# Altium project Soldeerbout_12002498.PrjPcb
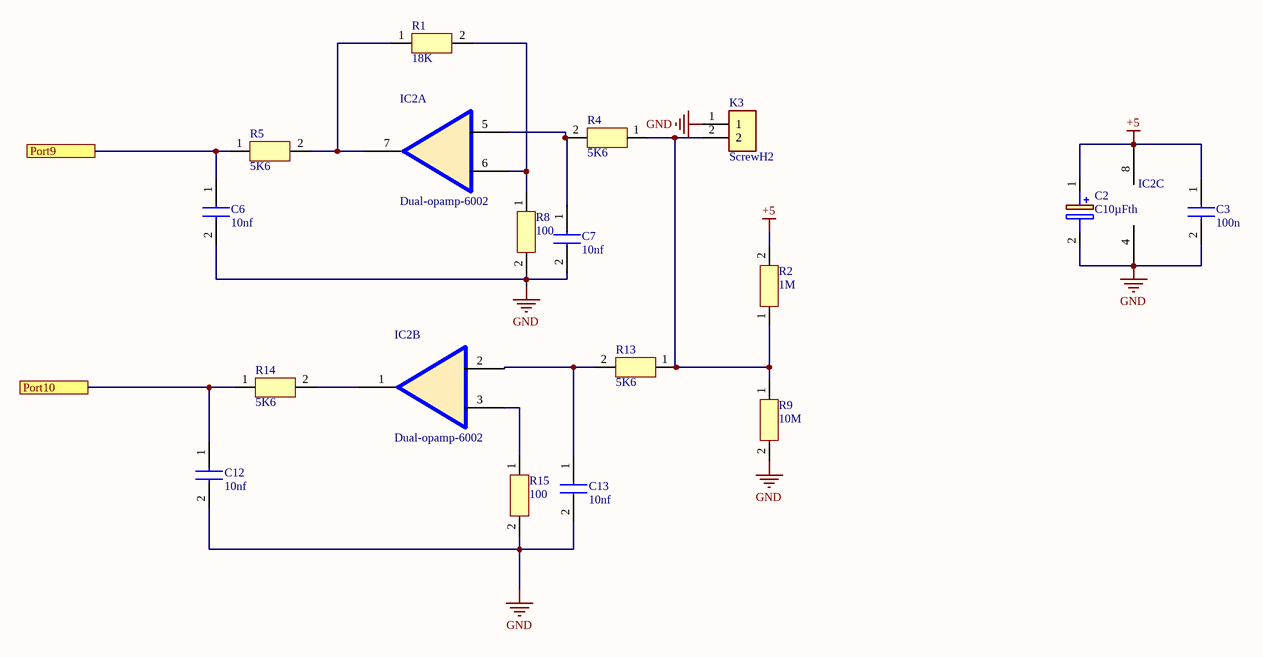
[diagram p0: Versterkers.SchDoc]
4 sheets, 53 parts. Net scope: flat (ports and power ports of the same name join across sheets).
Board file: Soldeerbout12002498.PcbDoc
Sheets:
  Versterkers.SchDoc
  Voeding.SchDoc
  Microchip.SchDoc
  TM16+LED.SchDoc

## Sheet Versterkers.SchDoc
size A4; SheetNumber: 2; SheetTotal: 5

### Parts
C2  C10µFth  [C10µFth]
C3  100n  [0805]
C6  10nf  [0805]
C7  10nf  [0805]
C12  10nf  [0805]
C13  10nf  [0805]
IC2  Dual-opamp-6002  [Dual-opamp-6002]  (parts A,B,C of 3)
K3  ScrewH2  [ScewH2]
R1  18K  [0805]
R2  1M  [0805]
R4  5K6  [0805]
R5  5K6  [0805]
R8  100  [0805]
R9  10M  [0805]
R13  5K6  [0805]
R14  5K6  [0805]
R15  100  [0805]

### Ports
Port9, Port10

### Nets
+5: C2.1(+) C3.1 IC2.8 R2.2
GND: C2.2(-) C3.2 C6.2 C7.2 C12.2 C13.2 IC2.4 K3.1 R8.2 R9.2 R15.2
NetC6_1: C6.1 R5.1 ; port Port9
NetC7_1: C7.1 IC2.5(Vin) R4.2
NetC12_1: C12.1 R14.1 ; port Port10
NetC13_1: C13.1 IC2.2(Vin) R13.2
NetIC2_1: IC2.1(Vout) R14.2
NetIC2_3: IC2.3(Vin-) R15.1
NetIC2_6: IC2.6(Vin-) R1.2 R8.1
NetIC2_7: IC2.7(Vout) R1.1 R5.2
NetK3_2: K3.2 R2.1 R4.1 R9.1 R13.1

### Library data of the parts
C2 = C10µFth: Capacitor Polarised; Manufacturer_Name: Panasonic; Manufacturer_Part_Number: ECA-1HM100I; Datasheet Link: https://componentsearchengine.com//ECA-1HM100I.pdf; Height: 12mm; Mouser2 Part Number: 667-ECA-1HM100I; Mouser2 Price/Stock: https://www.mouser.com/Search/Refine.aspx?Keyword=667-ECA-1HM100I
C3 C6 C7 C12 C13 = C0805smd: Capacitor; Manufacturer_Name: Kemet; Manufacturer_Part_Number: C0805C301G5GACTU; Datasheet Link: https://connect.kemet.com:7667/gateway/IntelliData-ComponentDocumentation/1.0/download/specsheet/C0805C301G5GACTU; Height: 0.88mm
IC2 = Dual-opamp-6002: Integrated Circuit; Manufacturer_Name: Microchip; Manufacturer_Part_Number: MCP6002-E/P; Datasheet Link: https://componentsearchengine.com//MCP6002-E_P.pdf; Height: 5.334mm; Mouser2 Part Number: 579-MCP6002-E/P; Mouser2 Price/Stock: https://www.mouser.com/Search/Refine.aspx?Keyword=579-MCP6002-E%2FP
K3 = ScrewH2: Connector; Manufacturer_Name: CUI Inc.; Manufacturer_Part_Number: TB007-508-02BE; Datasheet Link: https://componentsearchengine.com//TB007-508-02BE.pdf; Height: 14mm; Mouser2 Part Number: 490-TB007-508-02BE; Mouser2 Price/Stock: https://www.mouser.com/Search/Refine.aspx?Keyword=490-TB007-508-02BE
R1 R2 R4 R5 R8 R9 R13-R15 = R-0805: Resistor; Manufacturer_Name: Vishay; Manufacturer_Part_Number: TNPU0805500RAZEN00; Height: 0.55mm

## Sheet Voeding.SchDoc
size A4; SheetNumber: 3; SheetTotal: 5
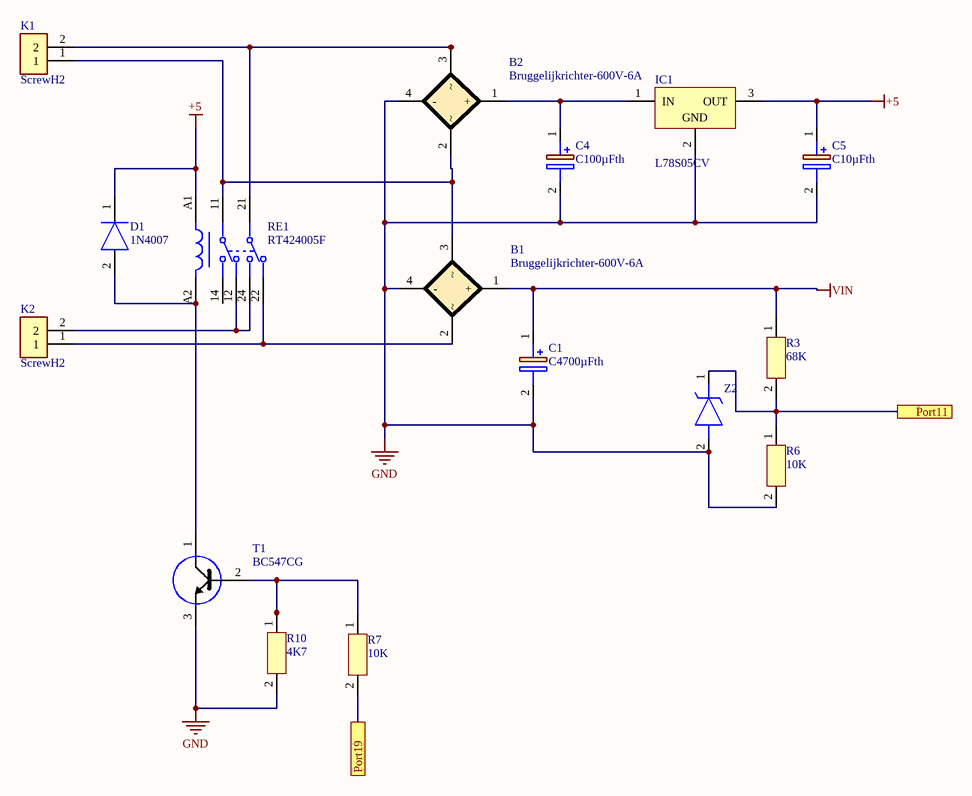
[diagram p1: Voeding.SchDoc]

### Parts
B1  Bruggelijkrichter-600V-6A  [Bruggelijkrichter-600V-6A]
B2  Bruggelijkrichter-600V-6A  [Bruggelijkrichter-600V-6A]
C1  C4700µFth  [C4700µFth]
C4  C100µFth  [C100µFth]
C5  C10µFth  [C10µFth]
D1  1N4007  [1N4007]
IC1  L78S05CV  [5V_Regulator-2A]
K1  ScrewH2  [ScewH2]
K2  ScrewH2  [ScewH2]
R3  68K  [0805]
R6  10K  [0805]
R7  10K  [0805]
R10  4K7  [0805]
RE1  RT424005F  [vermogenrelais-5VDC-8A]
T1  BC547CG  [BC547C]
Z2  zenerdiode-5,1V-0,5W  [zenerdiode-5,1V-0,5W]  (value not drawn)

### Ports
Port11, Port19

### Nets
+5: C5.1(+) D1.1(K) IC1.3(OUT) RE1.A1
GND: B1.4(-) B2.4(-) C1.2(-) C4.2(-) C5.2(-) IC1.2(GND) R6.2 R10.2 T1.3(E) Z2.2(A)
VIN: B1.1(+) C1.1(+) R3.1
NetB1_2: B1.2 K2.1 RE1.22
NetB1_3: B1.3 B2.2 K1.1 RE1.11
NetB2_1: B2.1(+) C4.1(+) IC1.1(IN)
NetB2_3: B2.3 K1.2 RE1.21
NetD1_2: D1.2(A) RE1.A2 T1.1(C)
NetIC3_19: R7.2 ; port Port19
NetK2_2: K2.2 RE1.12 RE1.24
NetR3_2: R3.2 R6.1 Z2.1(K) ; port Port11
NetR7_1: R7.1 R10.1 T1.2(B)

Not connected (* = marked no-connect by the designer): RE1 14

### Library data of the parts
B1 B2 = Bruggelijkrichter-600V-6A: Bridge Rectifier; Manufacturer_Name: Vishay; Manufacturer_Part_Number: GBU6J-E3/45; Datasheet Link: http://www.vishay.com/docs/88615/gbu6a.pdf; Height: 18.8mm
C1 = C4700µFth: Capacitor Polarised; Manufacturer_Name: Kemet; Manufacturer_Part_Number: ESK478M050AQ3AA; Datasheet Link: https://componentsearchengine.com//ESK478M050AQ3AA.pdf; Height: 37mm; Mouser2 Part Number: 80-ESK478M050AQ3AA; Mouser2 Price/Stock: https://www.mouser.com/Search/Refine.aspx?Keyword=80-ESK478M050AQ3AA
C4 = C100µFth: Capacitor Polarised; Manufacturer_Name: Kemet; Manufacturer_Part_Number: ESK107M050AG3EA; Height: 12.5mm
C5 = C10µFth: as C2 on sheet Versterkers; Datasheet Link: https://componentsearchengine.com//ECA-1HM100I.pdf; Height: 12mm; Mouser2 Part Number: 667-ECA-1HM100I; Mouser2 Price/Stock: https://www.mouser.com/Search/Refine.aspx?Keyword=667-ECA-1HM100I
D1 = 1N4007: Diode; Manufacturer_Name: Rectron; Manufacturer_Part_Number: 1N4007-T; Datasheet Link: https://componentsearchengine.com//1N4007-T.pdf; Mouser2 Part Number: 583-1N4007-T; Mouser2 Price/Stock: https://www.mouser.com/Search/Refine.aspx?Keyword=583-1N4007-T
IC1 = 5V_Regulator-2A: 2A Positive Voltage Regulator, 5V, 3-Pin TO-220; PackageVersion: ver3.0; ComponentLink2URL: http://www.st.com/internet/com/TECHNICAL_RESOURCES/TECHNICAL_LITERATURE/DATASHEET/CD00000449.pdf; ComponentLink1Description: Manufacturer URL; DatasheetVersion: 1/03/2010; PackageDescription: TO, Thru-Hole, Vertical, Heatsink Mounted; 3 In-Line Leads; Pitch 2.54 mm; ComponentLink2Description: Datasheet; ComponentLink1URL: http://www.st.com; ComponentLink3Description: Package Specification; PackageReference: TO220; ComponentLink3URL: http://www.st.com/internet/com/TECHNICAL_RESOURCES/TECHNICAL_LITERATURE/PACKAGE_INFORMATION/CD00004649.pdf
K1 K2 = ScrewH2: as K3 on sheet Versterkers; Datasheet Link: https://componentsearchengine.com//TB007-508-02BE.pdf; Height: 14mm; Mouser2 Part Number: 490-TB007-508-02BE; Mouser2 Price/Stock: https://www.mouser.com/Search/Refine.aspx?Keyword=490-TB007-508-02BE
R3 R6 R7 R10 = R-0805: as R1 on sheet Versterkers; Height: 0.55mm
RE1 = vermogenrelais-5VDC-8A: RELAY GENERAL PURPOSE DPDT 8A 5V; Power Consumption: 400mW; Coil Current: 80.6mA; Max Voltage Rating (AC): 400V; Coil Power: 500mW; Dropout Voltage: 500mV; Operate Time: 7ms; Contact Voltage Rating (AC): 250V; Coil Type: Non-Latching; Coil Resistance: 62R; Release Time: 3ms; Max Operating Temperature: 85°C; Package Quantity: 5000; Relay Type: General Purpose; Series: RT2; Lead Free: Lead Free; Coil Voltage (DC): 5V; Contact Current Rating: 8A; Packaging: Carton; Height: 15.7mm; Mount: Through Hole; Width: 12.7mm; ELV: Compliant; Termination: PCB; Contact Material: Silver; Throw Configuration: DPDT; Min Operating Temperature: -40°C; Weight: 13g; RoHS Compliant: Yes; Length: 29mm; Radiation Hardening: No
T1 = BC547C: Amplifier Transistor, NPN Silicon, 3-Pin TO-92, Pb-Free, Bulk Box; Manufacturer: On Semiconductor; IC Continuous (A): 0.1; fT Min (MHz): 150; ComponentLink3URL: http://www.onsemi.cn/pub_link/Collateral/2N6426-D.PDF; Mounting Technology: Through Hole; PackageReference: TO-92-3-29-11_AM_SL; ComponentLink2Description: Datasheet; RoHS: TRUE; Packing: Bulk Box; ComponentLink1Description: Manufacturer URL; PackageDescription: 3-Pin Transistor Outline, Body 4.825 x 3.685 mm, Pitch 1.27 mm; PackageVersion: Rev. AM; ComponentLink2URL: http://www.onsemi.com/pub_link/Collateral/BC546-D.PDF; ComponentLink3Description: Package Specification; ComponentLink1URL: http://www.onsemi.com/; DatasheetVersion: Rev. 7; Polarity: NPN; PartNumber: BC547CG
Z2 = zenerdiode-5,1V-0,5W: Zener Diode; Manufacturer_Name: ON Semiconductor; Manufacturer_Part_Number: MM5Z4689T1G; Datasheet Link: https://www.mouser.in/datasheet/2/308/1/MM5Z4678T1_D-2315920.pdf; Height: 0.7mm

## Sheet Microchip.SchDoc
size A4; SheetNumber: 4; SheetTotal: 6
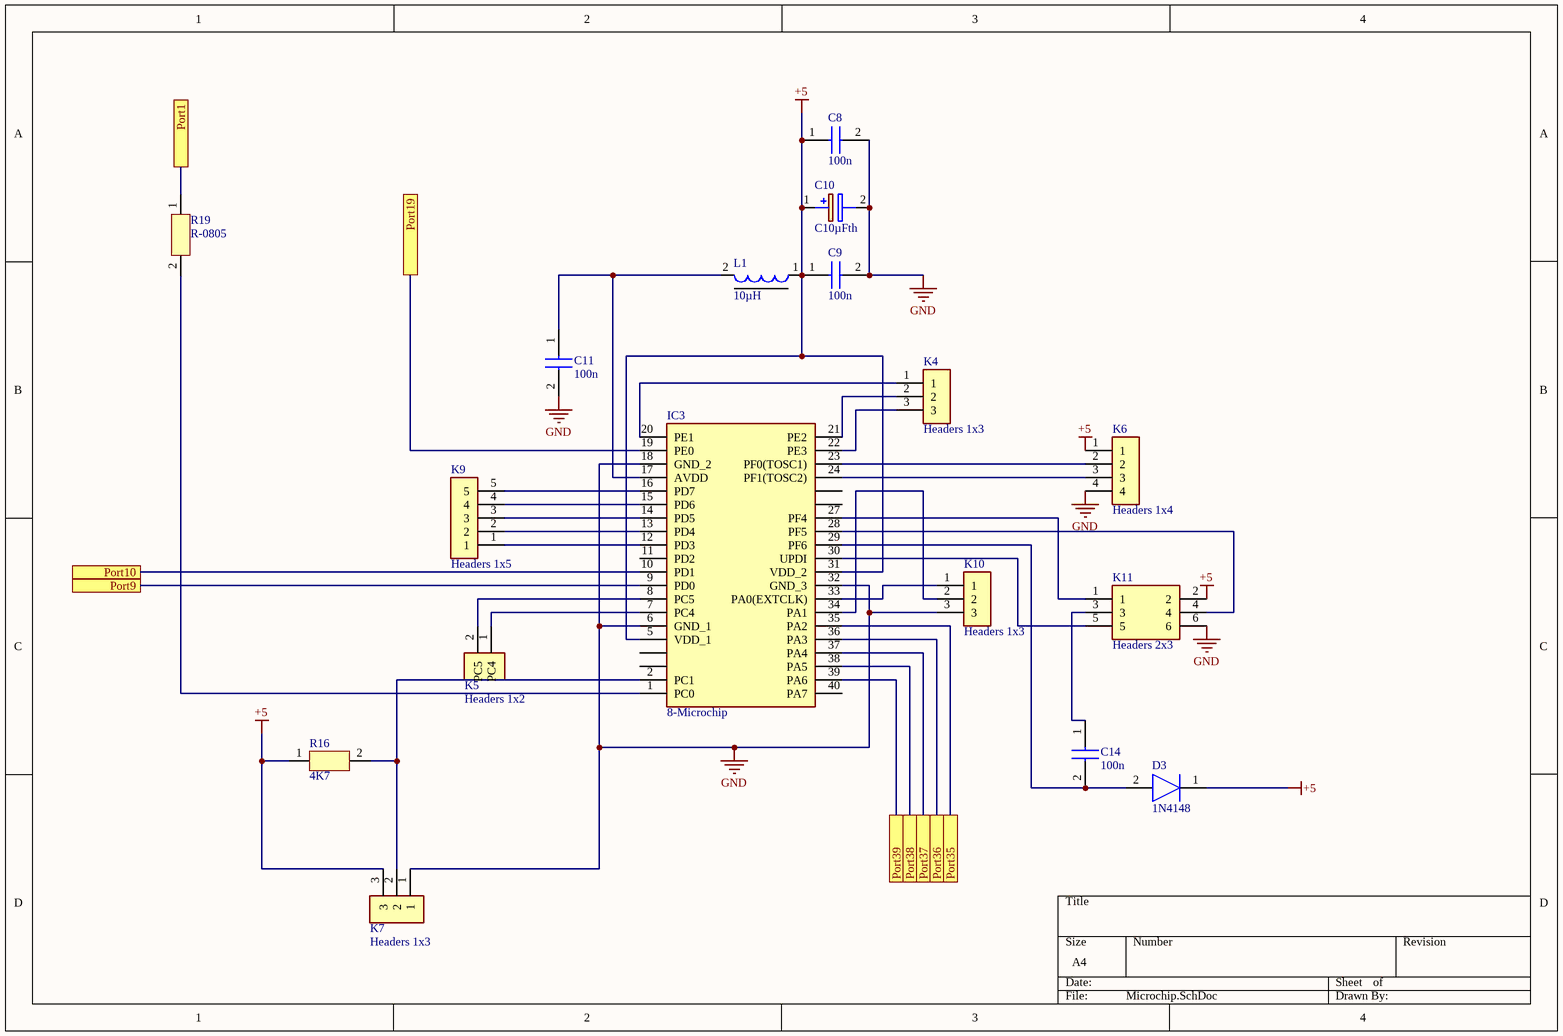
[diagram p2: Microchip.SchDoc]

### Parts
C8  100n  [0805]
C9  100n  [0805]
C10  C10µFth  [C10µFth]
C11  100n  [0805]
C14  100n  [0805]
D3  1N4148  [1N4148]
IC3  8-Microchip  [8-bit-MCU-ATMEGA4809-PF]
K4  Headers 1x3  [Headers 1x3]
K5  Headers 1x2  [Headers 1x2]
K6  Headers 1x4  [Headers 1x4]
K7  Headers 1x3  [Headers 1x3]
K9  Headers 1x5  [Headers 1x5]
K10  Headers 1x3  [Headers 1x3]
K11  Headers 2x3  [Headers 2x3]
L1  10µH  [Smoorspoel-130mA]
R16  4K7  [0805]
R19  R-0805  [0805]

### Ports
Port1, Port9, Port10, Port19, Port35, Port36, Port37, Port38, Port39

### Nets
+5: C8.1 C9.1 C10.1(+) D3.1(K) IC3.5(VDD_1) IC3.31(VDD_2) K6.1 K7.3 K11.2 L1.1 R16.1
GND: C8.2 C9.2 C10.2(-) C11.2 IC3.6(GND_1) IC3.18(GND_2) IC3.32(GND_3) K6.4 K7.1 K10.3 K11.6
NetC6_1: IC3.9(PD0) ; port Port9
NetC11_1: C11.1 IC3.17(AVDD) L1.2
NetC12_1: IC3.10(PD1) ; port Port10
NetC14_1: C14.1 K11.3
NetC14_2: C14.2 D3.2(A) IC3.29(PF6)
NetIC3_1: IC3.1(PC0) R19.2
NetIC3_2: IC3.2(PC1) K7.2 R16.2
NetIC3_7: IC3.7(PC4) K5.1(PC4)
NetIC3_8: IC3.8(PC5) K5.2(PC5)
NetIC3_12: IC3.12(PD3) K9.1
NetIC3_13: IC3.13(PD4) K9.2
NetIC3_14: IC3.14(PD5) K9.3
NetIC3_15: IC3.15(PD6) K9.4
NetIC3_16: IC3.16(PD7) K9.5
NetIC3_19: IC3.19(PE0) ; port Port19
NetIC3_20: IC3.20(PE1) K4.1
NetIC3_21: IC3.21(PE2) K4.2
NetIC3_22: IC3.22(PE3) K4.3
NetIC3_23: IC3.23(PF0(TOSC1)) K6.2
NetIC3_24: IC3.24(PF1(TOSC2)) K6.3
NetIC3_27: IC3.27(PF4) K11.1
NetIC3_28: IC3.28(PF5) K11.4
NetIC3_30: IC3.30(UPDI) K11.5
NetIC3_33: IC3.33(PA0(EXTCLK)) K10.1
NetIC3_34: IC3.34(PA1) K10.2
NetIC3_35: IC3.35(PA2) ; port Port35
NetIC3_36: IC3.36(PA3) ; port Port36
NetIC3_37: IC3.37(PA4) ; port Port37
NetIC3_38: IC3.38(PA5) ; port Port38
NetIC3_39: IC3.39(PA6) ; port Port39
NetR19_1: R19.1 ; port Port1

Not connected (* = marked no-connect by the designer): IC3 3(PC2) 4(PC3) 11(PD2) 25(PF2) 26(PF3) 40(PA7)

### Library data of the parts
C8 C9 C11 C14 = C0805smd: as C3 on sheet Versterkers; Datasheet Link: https://connect.kemet.com:7667/gateway/IntelliData-ComponentDocumentation/1.0/download/specsheet/C0805C301G5GACTU; Height: 0.88mm
C10 = C10µFth: as C2 on sheet Versterkers; Datasheet Link: https://componentsearchengine.com//ECA-1HM100I.pdf; Height: 12mm; Mouser2 Part Number: 667-ECA-1HM100I; Mouser2 Price/Stock: https://www.mouser.com/Search/Refine.aspx?Keyword=667-ECA-1HM100I
D3 = 1N4148: Diode; Manufacturer_Name: Nexperia; Datasheet Link: https://datasheet.datasheetarchive.com/originals/distributors/Datasheets-112/DSAP0040891.pdf; Manufacturer_Part_Number: 1N4148
IC3 = 8-Microchip: Integrated Circuit; Manufacturer_Part_Number: ATMEGA4809-PF; Datasheet Link: https://componentsearchengine.com//ATMEGA4809-PF.pdf; Height: 6.35mm; Mouser2 Part Number: 556-ATMEGA4809-PF; Mouser2 Price/Stock: https://www.mouser.com/Search/Refine.aspx?Keyword=556-ATMEGA4809-PF; Manufacturer_Name: Microchip
K4 K7 K10 = Headers 1x3: Connector; Manufacturer_Name: TE Connectivity; Manufacturer_Part_Number: 2-826646-0; Datasheet Link: https://componentsearchengine.com/Datasheets/1/2-826646-0.pdf; Height: 8.8mm
K5 = Headers 1x2: Connector; Manufacturer_Name: TE Connectivity; Manufacturer_Part_Number: 2-826646-0; Datasheet Link: https://componentsearchengine.com/Datasheets/1/2-826646-0.pdf; Height: 8.8mm
K6 = Headers 1x4: Connector; Manufacturer_Name: TE Connectivity; Manufacturer_Part_Number: 2-826646-0; Datasheet Link: https://componentsearchengine.com/Datasheets/1/2-826646-0.pdf; Height: 8.8mm
K9 = Headers 1x5: Connector; Manufacturer_Name: TE Connectivity; Manufacturer_Part_Number: 2-826646-0; Datasheet Link: https://componentsearchengine.com/Datasheets/1/2-826646-0.pdf; Height: 8.8mm
K11 = Headers 2x3: Connector; Manufacturer_Name: Harwin; Manufacturer_Part_Number: M20-9761042; Datasheet Link: https://componentsearchengine.com//M20-9761042.pdf; Height: 8.38mm; Mouser2 Part Number: 855-M20-9761042; Mouser2 Price/Stock: https://www.mouser.com/Search/Refine.aspx?Keyword=855-M20-9761042
L1 = Smoorspoel-130mA: THT Common Mode Power Line Choke WE-CMB, L = 1.00 mH; Inductance: 1.00 mH; PackageDescription: THT Inductor, 4-Leads, Body 27.5 x 18.5 mm; PackageReference: WE-CMB-L; PackageVersion: 2004; ComponentLink2URL: http://www.we-online.de/katalog/media/pdf/744824101.pdf; ComponentLink2Description: Datasheet; ComponentLink1Description: Manufacturer Link; DatasheetVersion: ver 5, Oct-2004; ComponentLink1URL: http://www.we-online.com
R16 R19 = R-0805: as R1 on sheet Versterkers; Height: 0.55mm

## Sheet TM16+LED.SchDoc
size A4; SheetNumber: 6; SheetTotal: 6
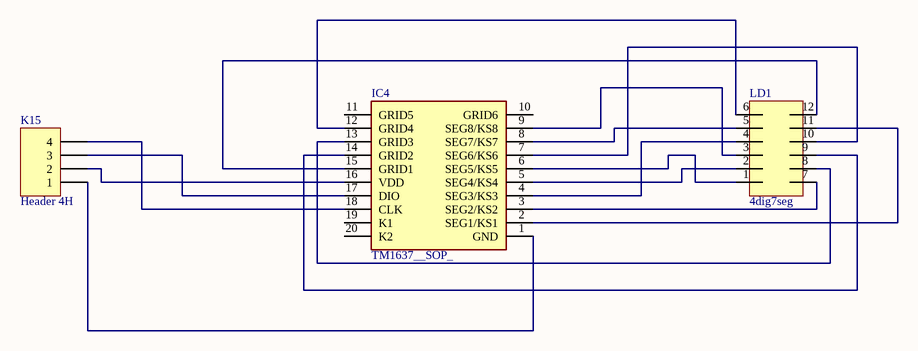
[diagram p3: TM16+LED.SchDoc]

### Parts
IC4  TM1637__SOP_  [SOIC127P1045X280-20N]
K15  Header 4H  [HDR1X4H]
LD1  4dig7seg  [4Digit7seg]

### Nets
NetIC4_1: IC4.1(GND) K15.1
NetIC4_2: IC4.2(SEG1/KS1) LD1.11
NetIC4_3: IC4.3(SEG2/KS2) LD1.7
NetIC4_4: IC4.4(SEG3/KS3) LD1.4
NetIC4_5: IC4.5(SEG4/KS4) LD1.2
NetIC4_6: IC4.6(SEG5/KS5) LD1.1
NetIC4_7: IC4.7(SEG6/KS6) LD1.10
NetIC4_8: IC4.8(SEG7/KS7) LD1.5
NetIC4_9: IC4.9(SEG8/KS8) LD1.3
NetIC4_12: IC4.12(GRID4) LD1.6
NetIC4_13: IC4.13(GRID3) LD1.8
NetIC4_14: IC4.14(GRID2) LD1.9
NetIC4_15: IC4.15(GRID1) LD1.12
NetIC4_16: IC4.16(VDD) K15.2
NetIC4_17: IC4.17(DIO) K15.3
NetIC4_18: IC4.18(CLK) K15.4

Not connected (* = marked no-connect by the designer): IC4 10(GRID6) 11(GRID5) 19(K1) 20(K2)

### Library data of the parts
IC4 = TM1637__SOP_: Integrated Circuit; Manufacturer_Name: TITAN MICRO ELECTRONICS; Manufacturer_Part_Number: TM1637 (SOP); Datasheet Link: https://www.mcielectronics.cl/website_MCI/static/documents/Datasheet_TM1637.pdf; Height: 2.8mm
K15 = Header 4H: Header, 4-Pin, Right Angle; LatestRevisionDate: 17-Jul-2002; LatestRevisionNote: Re-released for DXP Platform.; Publisher: Altium Limited

## Nets that join several sheets
+5: Versterkers (C2.1 C3.1 IC2.8 R2.2), Voeding (C5.1 D1.1 IC1.3 RE1.A1), Microchip (11 pins)
GND: Versterkers (11 pins), Voeding (10 pins), Microchip (11 pins)
NetC6_1: Versterkers (C6.1 R5.1), Microchip (IC3.9)
NetC12_1: Versterkers (C12.1 R14.1), Microchip (IC3.10)
NetIC3_19: Voeding (R7.2), Microchip (IC3.19)